# EasyEDA Pro project 无刷电机驱动板.epro, schematic 舵机降压测试板
Board Name: Board2; Create Date: 2024-12-31; Page Name: P1; Project Name: 无刷电机驱动板; Schematic Name: 舵机降压测试板; Update Date: 2024-12-31; Company: 嘉立创EDA; Page Size: A4; Version: V1.0
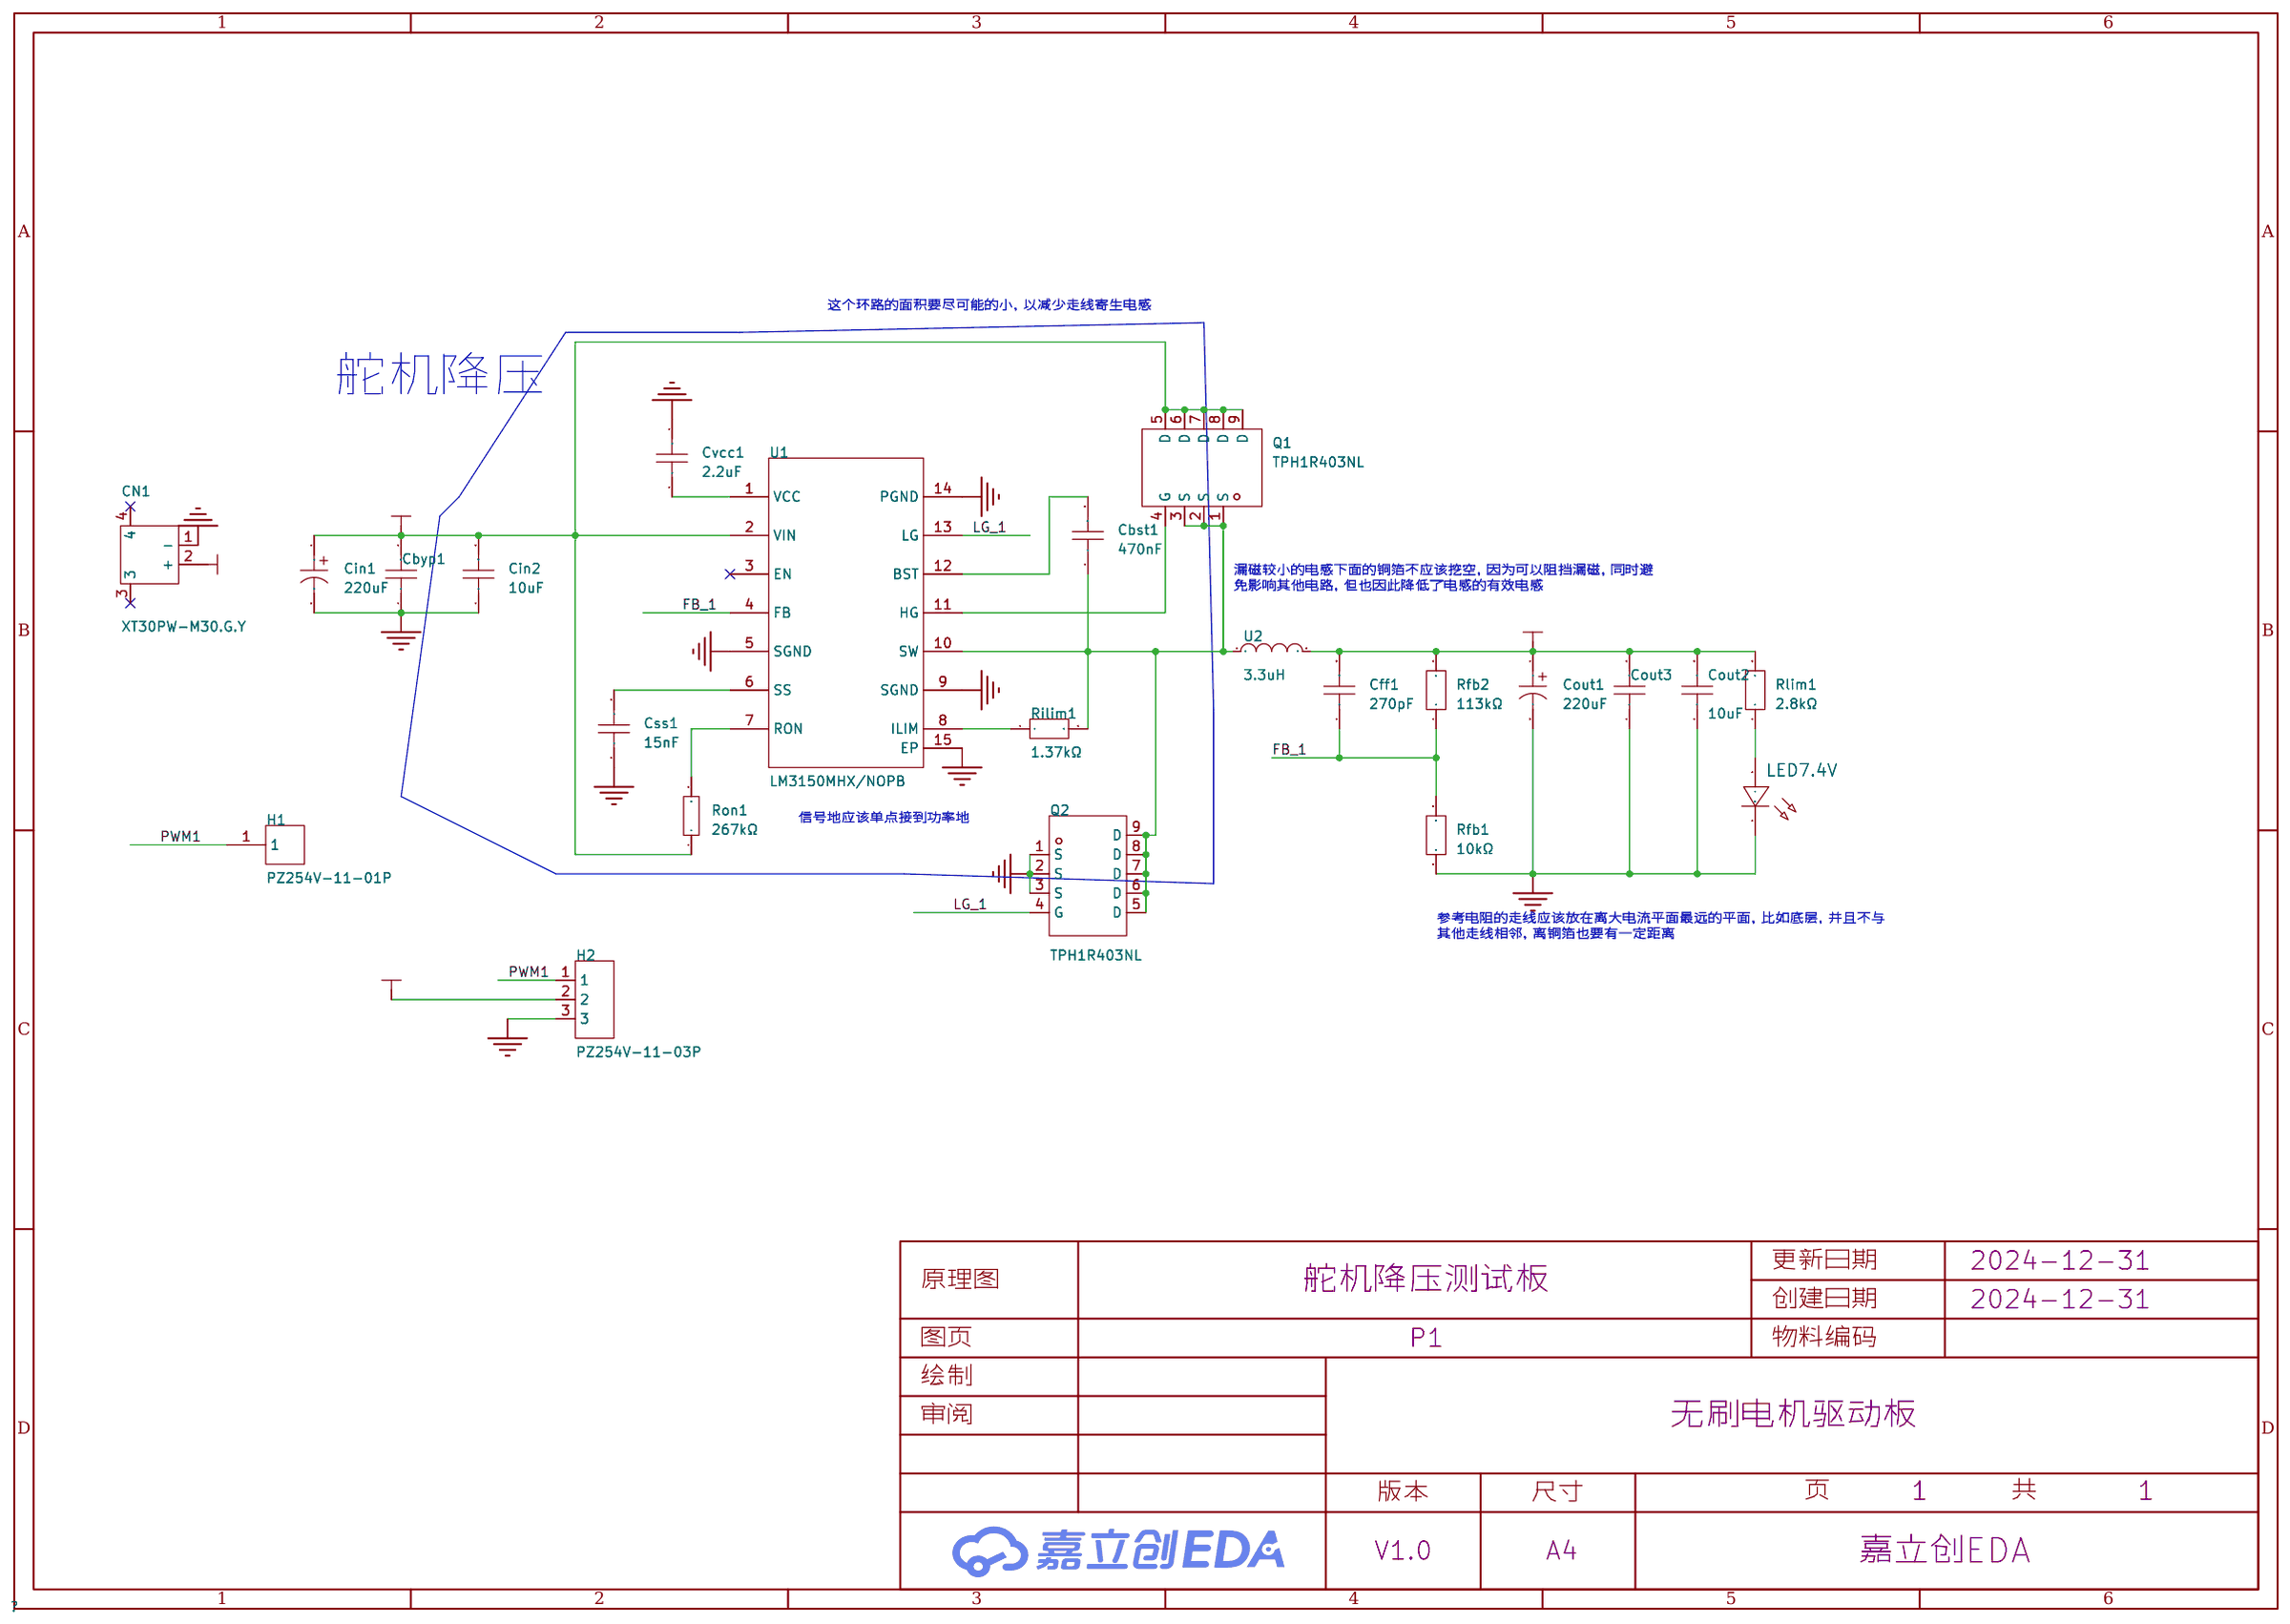
[diagram p1: schematic sheet]

## Parts
Cbst1  470nF  [CAP-SMD_L1.6-W0.8-3]
Cbyp1  100nF  [C0603]
Cff1  270pF  [C0603]
Cin1  220uF  [CAP-SMD_BD6.3-L6.6-W6.6-LS7.4-FD]
Cin2  10uF  [C0805]
CN1  XT30PW-M30.G.Y  [CONN-TH_XT30PW-M]
Cout1  220uF  [CAP-SMD_BD6.3-L6.6-W6.6-LS7.4-FD]
Cout2  10uF  [C0805]
Cout3  100nF  [C0603]
Css1  15nF  [C0603]
Cvcc1  2.2uF  [C0805]
H1  PZ254V-11-01P  [HDR-TH_1P-P2.54-V-M]
H2  PZ254V-11-03P  [HDR-TH_3P-P2.54-V-M]
LED7.4V  -  [LED_0603]
Q1  TPH1R403NL  [DSOP-8_L5.0-W5.0-P1.27-LS6.0-BL-EP]
Q2  TPH1R403NL  [DSOP-8_L5.0-W5.0-P1.27-LS6.0-BL-EP]
Rfb1  10kΩ  [R0603]
Rfb2  113kΩ  [R0603]
Rilim1  1.37kΩ  [R0603]
Rlim1  2.8kΩ  [R0603]
Ron1  267kΩ  [R0603]
U1  LM3150MHX/NOPB  [HTSSOP-14_L5.0-W4.4-P0.65-LS6.4-BL-EP]
U2  3.3uH  [IND-SMD_L7.8-W7.6]

## Library data of the parts
Cbst1 = CC0603KRX7R9BB474: 容值:470nF;精度:±10%;额定电压:50V;材质(温度系数):X7R;; LCSC Part Name: 470nF ±10% 50V; Supplier Part: C513577; Manufacturer: YAGEO(国巨); Supplier Footprint: 0603; JLCPCB Part Class: 扩展库; Datasheet: https://atta.szlcsc.com/upload/public/pdf/source/20200423/C519417_FF9998E3F66D767819CD86A66B468321.pdf; Supplier: LCSC; Tolerance: ±10%; Voltage Rated: 50V; Temperature Coefficient: X7R
Cbyp1 Cout3 = CC0603KRX7R9BB104: 容值:100nF;精度:±10%;额定电压:50V;材质(温度系数):X7R;; LCSC Part Name: 100nF ±10% 50V; Supplier Part: C14663; Manufacturer: YAGEO(国巨); Supplier Footprint: 0603; JLCPCB Part Class: 基础库; Datasheet: https://atta.szlcsc.com/upload/public/pdf/source/20180910/C282072_33301C7F631E79921B82A8DAC6BCC5B3.pdf; Supplier: LCSC; Tolerance: ±10%; Voltage Rated: 50V; Temperature Coefficient: X7R
Cff1 = CL10C271JB8NNNC: 容值:270pF;精度:±5%;额定电压:50V;材质(温度系数):C0G;; LCSC Part Name: 270pF ±5% 50V; Supplier Part: C1657; Manufacturer: SAMSUNG(三星); Supplier Footprint: 0603; JLCPCB Part Class: 扩展库; Datasheet: https://atta.szlcsc.com/upload/public/pdf/source/20160218/1457707763339.pdf; Supplier: LCSC; Tolerance: ±5%; Voltage Rated: 50V; Temperature Coefficient: C0G
Cin1 Cout1 = RVT1E221M0607: 容值:220uF;精度:±20%;额定电压:25V;纹波电流:150mA@120Hz;等效串联电阻:-;; LCSC Part Name: 220uF ±20% 25V; Supplier Part: C2918361; Manufacturer: ROQANG(容强); Supplier Footprint: SMD,D6.3xL7.7mm; JLCPCB Part Class: 扩展库; Datasheet: https://atta.szlcsc.com/upload/public/pdf/source/20211118/497C0614266278696CA52BDF245B991F.pdf; Supplier: LCSC; Tolerance: ±20%; Rated Voltage: 25V; Ripple Current: 150mA@120Hz; φD: 6.3mm; L: 7.7mm; Lifetime @ Temp: 2000hrs@105℃; Operating Temperature: -40℃~+105℃
Cin2 Cout2 = GRM21BR61H106KE43L: 容值:10uF;精度:±10%;额定电压:50V;材质(温度系数):X5R;; LCSC Part Name: 10uF ±10% 50V; Supplier Part: C440198; Manufacturer: muRata(村田); Supplier Footprint: 0805; JLCPCB Part Class: 基础库; Datasheet: https://atta.szlcsc.com/upload/public/pdf/source/20230811/95AAE0C9AF55EDC31B7A4D8B733F534E.pdf; Supplier: LCSC; Tolerance: ±10%; Voltage Rated: 50V; Temperature Coefficient: X5R
CN1 = XT30PW-M30.G.Y: 类别:-;类型1:-;; LCSC Part Name: AMASS(艾迈斯)航模插头 卧式弯脚 XT30PW-M公头; Supplier Part: C431092; Manufacturer: AMASS(艾迈斯); JLCPCB Part Class: 扩展库; Datasheet: https://atta.szlcsc.com/upload/public/pdf/source/20220222/6A9F22F7850E25B33E1BE430ADF8560B.pdf; Supplier: LCSC; Type: 航模插头; RatedVoltage: DC 500V; InterfaceType: 公头; RatedCurrent: 15A; RecommendedWireGauge: 16/18/20AWG; contact resistance: 1.2mΩ; specifications: 2pin
Css1 = CC0603JRX7R9BB153: 容值:15nF;精度:±5%;额定电压:50V;材质(温度系数):X7R;; LCSC Part Name: 15nF ±5% 50V; Supplier Part: C519550; Manufacturer: YAGEO(国巨); Supplier Footprint: 0603; JLCPCB Part Class: 扩展库; Datasheet: https://atta.szlcsc.com/upload/public/pdf/source/20200423/C519550_A1941788CCD45C6ADF0AD0CE4A47CC49.pdf; Supplier: LCSC; Tolerance: ±5%; Voltage Rated: 50V; Temperature Coefficient: X7R
Cvcc1 = CL21A225KBQNNNE: 容值:2.2uF;精度:±10%;额定电压:50V;材质(温度系数):X5R;; LCSC Part Name: 2.2uF ±10% 50V; Supplier Part: C377773; Manufacturer: SAMSUNG(三星); Supplier Footprint: 0805; JLCPCB Part Class: 基础库; Datasheet: https://atta.szlcsc.com/upload/public/pdf/source/20160218/1457707763339.pdf; Supplier: LCSC; Tolerance: ±10%; Voltage Rated: 50V; Temperature Coefficient: X5R
H1 = PZ254V-11-01P: 插针结构:1x1P;间距:2.54mm;行距:-;圆针/方针:方针;安装类型:直插;排数:单排;总PIN位数:1P;额定电流:-;额定电压:-;配合针长度:6mm;塑高:2.5mm;端接针长度:3mm;触头材质:黄铜;触头镀层:-;工作温度范围:-40℃~+105℃;颜色:黑色;; LCSC Part Name: 间距:2.54mm 1x1P 直插 方针; Supplier Part: C492400; Manufacturer: XFCN(兴飞); Supplier Footprint: 插件,P=2.54mm; JLCPCB Part Class: 扩展库; Datasheet: https://atta.szlcsc.com/upload/public/pdf/source/20200309/C492400_46876A5B545F5AE6B8D4A09C46E276E8.pdf; Supplier: LCSC; Pin Structure: 1x1P; Pitch: 2.54mm; Circluar Pins/Square Pins: 方针; Mounting Type: 直插; Number of Rows: 单排; Number of Pins: 1P; Length of Mating Pin: 6mm; Insulation Height: 2.5mm; Length of End Connection Pin: 3mm; Contact Material: 黄铜; Operating Temperature Range: -40℃~+105℃; Color: 黑色
H2 = PZ254V-11-03P: 插针结构:1x3P;间距:2.54mm;行距:-;圆针/方针:方针;安装类型:直插;排数:单排;总PIN位数:3P;额定电流:3A;额定电压:250V;配合针长度:6mm;塑高:2.5mm;端接针长度:3mm;工作温度范围:-40℃~+105℃;颜色:黑色;; LCSC Part Name: 间距:2.54mm 1x3P 直插 方针; Supplier Part: C2937625; Manufacturer: XFCN(兴飞); Supplier Footprint: 插件,P=2.54mm; JLCPCB Part Class: 扩展库; Datasheet: https://atta.szlcsc.com/upload/public/pdf/source/20200309/C492402_8335C3D49C4E4C618838D59BB1D024C1.pdf; Supplier: LCSC; Pin Structure: 1x3P; Pitch: 2.54mm; Circluar Pins/Square Pins: 方针; Mounting Type: 直插; Number of Rows: 单排; Number of Pins: 3P; Current Rating (Max): 3A; Voltage Rating (Max): 250V; Length of Mating Pin: 6mm; Insulation Height: 2.5mm; Length of End Connection Pin: 3mm; Operating Temperature Range: -40℃~+105℃; Color: 黑色
LED7.4V = LED_0603-R: Supplier Footprint: 0603
Q1 Q2 = TPH1R403NL_C83440: 类型:1个N沟道;漏源电压(Vdss):30V;连续漏极电流(Id):150A;导通电阻(RDS(on)@Vgs,Id):1.7mΩ@4.5V,30A;功率:64W;阈值电压(Vgs(th)@Id):1.3V@0.5mA;; LCSC Part Name: 1个N沟道 耐压:30V 电流:150A; Supplier Part: C83440; Manufacturer: TOSHIBA(东芝); Supplier Footprint: DFN-8(5x6); JLCPCB Part Class: 扩展库; Datasheet: https://atta.szlcsc.com/upload/public/pdf/source/20170908/C83440_1504870121708958077.pdf; Supplier: LCSC; Type: 1个N沟道; Drain Source Voltage (Vdss): 30V; Continuous Drain Current (Id): 150A; Drain Source On Resistance (RDS(on)@Vgs,Id): 1.7mΩ@4.5V,30A; Power Dissipation (Pd): 64W; Gate Threshold Voltage (Vgs(th)@Id): 1.3V@0.5mA; Total Gate Charge (Qg@Vgs): 46nC@15V; Input Capacitance (Ciss@Vds): 3.4nF@15V; Reverse Transfer Capacitance (Crss@Vds): 200pF@15V; Operating Temperature: -55℃~+150℃
Rfb1 = FRC0603J103TS: 电阻类型:厚膜电阻;阻值:10kΩ;精度:±5%;功率:100mW;最大工作电压:75V;温度系数:±100ppm/℃;; LCSC Part Name: 10kΩ ±5% 100mW 厚膜电阻; Supplier Part: C2930027; Manufacturer: FOJAN(富捷); Supplier Footprint: 0603; JLCPCB Part Class: 扩展库; Datasheet: https://atta.szlcsc.com/upload/public/pdf/source/20211221/925EC7D7225764EE0046F22065062C87.pdf; Supplier: LCSC; Type: 厚膜电阻; Tolerance: ±5%; Power(Watts): 100mW; Overload Voltage (Max): 75V; Temperature Coefficient: ±100ppm/℃; Operating Temperature Range: -55℃~+155℃
Rfb2 = RT0603BRE07113KL: 电阻类型:薄膜电阻;阻值:113kΩ;精度:±0.1%;功率:100mW;温度系数:±50ppm/℃;; LCSC Part Name: 薄膜电阻 113kΩ ±0.1% 100mW; Supplier Part: C861633; Manufacturer: YAGEO(国巨); Supplier Footprint: 0603; JLCPCB Part Class: 扩展库; Datasheet: https://atta.szlcsc.com/upload/public/pdf/source/20200610/C326738_5639A9F1B6EB6E4AE2197577D3456E7F.pdf; Supplier: LCSC; Type: 薄膜电阻; Tolerance: ±0.1%; Power(Watts): 100mW; Temperature Coefficient: ±50ppm/℃; Operating Temperature Range: -55℃~+155℃
Rilim1 = RT0603CRE071K37L: 电阻类型:薄膜电阻;阻值:1.37kΩ;精度:±0.25%;功率:100mW;最大工作电压:75V;温度系数:±50ppm/℃;; LCSC Part Name: 薄膜电阻 1.37kΩ ±0.25% 100mW; Supplier Part: C705911; Manufacturer: YAGEO(国巨); Supplier Footprint: 0603; JLCPCB Part Class: 扩展库; Datasheet: https://atta.szlcsc.com/upload/public/pdf/source/20200720/C705911_C0C0480A0E18114730977775B5293834.pdf; Supplier: LCSC; Type: 薄膜电阻; Tolerance: ±0.25%; Power(Watts): 100mW; Overload Voltage (Max): 75V; Temperature Coefficient: ±50ppm/℃; Operating Temperature Range: -55℃~+155℃
Rlim1 = FRC0603F2801TS: 电阻类型:厚膜电阻;阻值:2.8kΩ;精度:±1%;功率:100mW;最大工作电压:75V;温度系数:±100ppm/℃;; LCSC Part Name: 2.8kΩ ±1% 100mW 厚膜电阻; Supplier Part: C2933188; Manufacturer: FOJAN(富捷); Supplier Footprint: 0603; JLCPCB Part Class: 扩展库; Datasheet: https://atta.szlcsc.com/upload/public/pdf/source/20211221/925EC7D7225764EE0046F22065062C87.pdf; Supplier: LCSC; Type: 厚膜电阻; Tolerance: ±1%; Power(Watts): 100mW; Overload Voltage (Max): 75V; Temperature Coefficient: ±100ppm/℃; Operating Temperature Range: -55℃~+155℃
Ron1 = 0603WAF2673T5E: 电阻类型:厚膜电阻;阻值:267kΩ;精度:±1%;功率:100mW;最大工作电压:75V;温度系数:±100ppm/℃;; LCSC Part Name: 267kΩ ±1% 100mW 厚膜电阻; Supplier Part: C22963; Manufacturer: UNI-ROYAL(厚声); Supplier Footprint: 0603; JLCPCB Part Class: 扩展库; Datasheet: https://atta.szlcsc.com/upload/public/pdf/source/20200306/C422600_1E6D84923E4A46A82E41ADD87F860B5C.pdf; Supplier: LCSC; Type: 厚膜电阻; Tolerance: ±1%; Power(Watts): 100mW; Overload Voltage (Max): 75V; Temperature Coefficient: ±100ppm/℃; Operating Temperature Range: -55℃~+155℃
U1 = LM3150MHX/NOPB: 功能类型:降压型;输出类型:可调;工作电压:6V~42V;输出电压:600mV~3.3V;输出电流:12A;; LCSC Part Name: LM3150 宽输入电压同步降压控制器; Supplier Part: C48112; Manufacturer: TI(德州仪器); Supplier Footprint: HTSSOP-14-EP; JLCPCB Part Class: 扩展库; Datasheet: https://www.ti.com/cn/lit/gpn/lm3150; Supplier: LCSC; Function: 降压型; Output Type: 可调; Input Voltage: 6V~42V; Output Voltage: 600mV~3.3V; Output Current: 12A; Switching Frequency: 500kHz; Operating Temperature: -40℃~+125℃; Synchronous Rectification: 是; Number of Outputs: 1; Topology: 降压式; Switch tube (built-in/external): 外置
U2 = YSPIT0770A-3R3M: 电感值:3.3uH;精度:±20%;额定电流:15.1A;饱和电流(Isat):19.4A;类型:一体成型电感;; LCSC Part Name: 3.3uH ±20% 19.4A; Supplier Part: C19190806; Manufacturer: YJYCOIN(益嘉源); Supplier Footprint: SMD,7.6x7.8mm; Datasheet: https://atta.szlcsc.com/upload/public/pdf/source/20231103/4584E541A7477EF2C0EF6FA736417A6E.pdf; Supplier: LCSC; Tolerance: ±20%; Rated Current: 15.1A; Saturation Current (Isat): 19.4A; DC Resistance (DCR): 9.5mΩ; Type: 一体成型电感

## Nets
7.4V_1: Cff1.2 Cout1.1 Cout2.2 Cout3.2 H2.2 Rfb2.2 Rlim1.2 U2.2
GND: Cbyp1.1 Cin1.2 Cin2.1 CN1.1(-) Cout1.2 Cout2.1 Cout3.1 Css1.1 Cvcc1.1 H2.3 LED7.4V.1(C) Q2.1(S) Q2.2(S) Q2.3(S) Rfb1.1 U1.5(SGND) U1.9(SGND) U1.14(PGND) U1.15(EP)
VIN: Cbyp1.2 Cin1.1 Cin2.2 CN1.2(+) Q1.5(D) Q1.6(D) Q1.7(D) Q1.8(D) Q1.9(D) Ron1.1 U1.2(VIN)
FB_1: Cff1.1 Rfb1.2 Rfb2.1 U1.4(FB)
LG_1: Q2.4(G) U1.13(LG)
PWM1: H1.1 H2.1
$1N2026: Cbst1.1 Q1.1(S) Q1.2(S) Q1.3(S) Q2.5(D) Q2.6(D) Q2.7(D) Q2.8(D) Q2.9(D) Rilim1.2 U1.10(SW) U2.1
$1N2028: Cbst1.2 U1.12(BST)
$1N2031: Q1.4(G) U1.11(HG)
$1N2032: Rilim1.1 U1.8(ILIM)
$1N2045: LED7.4V.2(A) Rlim1.1
$1N2048: Cvcc1.2 U1.1(VCC)
$1N2050: Ron1.2 U1.7(RON)
$1N2054: Css1.2 U1.6(SS)

Not connected (* = marked no-connect by the designer): CN1 3* 4*; U1 3(EN)*

## Notes on the sheet
- 这个环路的面积要尽可能的小，以减少走线寄生电感
- 舵机降压
- 漏磁较小的电感下面的铜箔不应该挖空，因为可以阻挡漏磁，同时避
  免影响其他电路，但也因此降低了电感的有效电感
- 信号地应该单点接到功率地
- 参考电阻的走线应该放在离大电流平面最远的平面，比如底层，并且不与
  其他走线相邻，离铜箔也要有一定距离
